# EAGLE design logicka sonda (EAGLE 7.7.0)
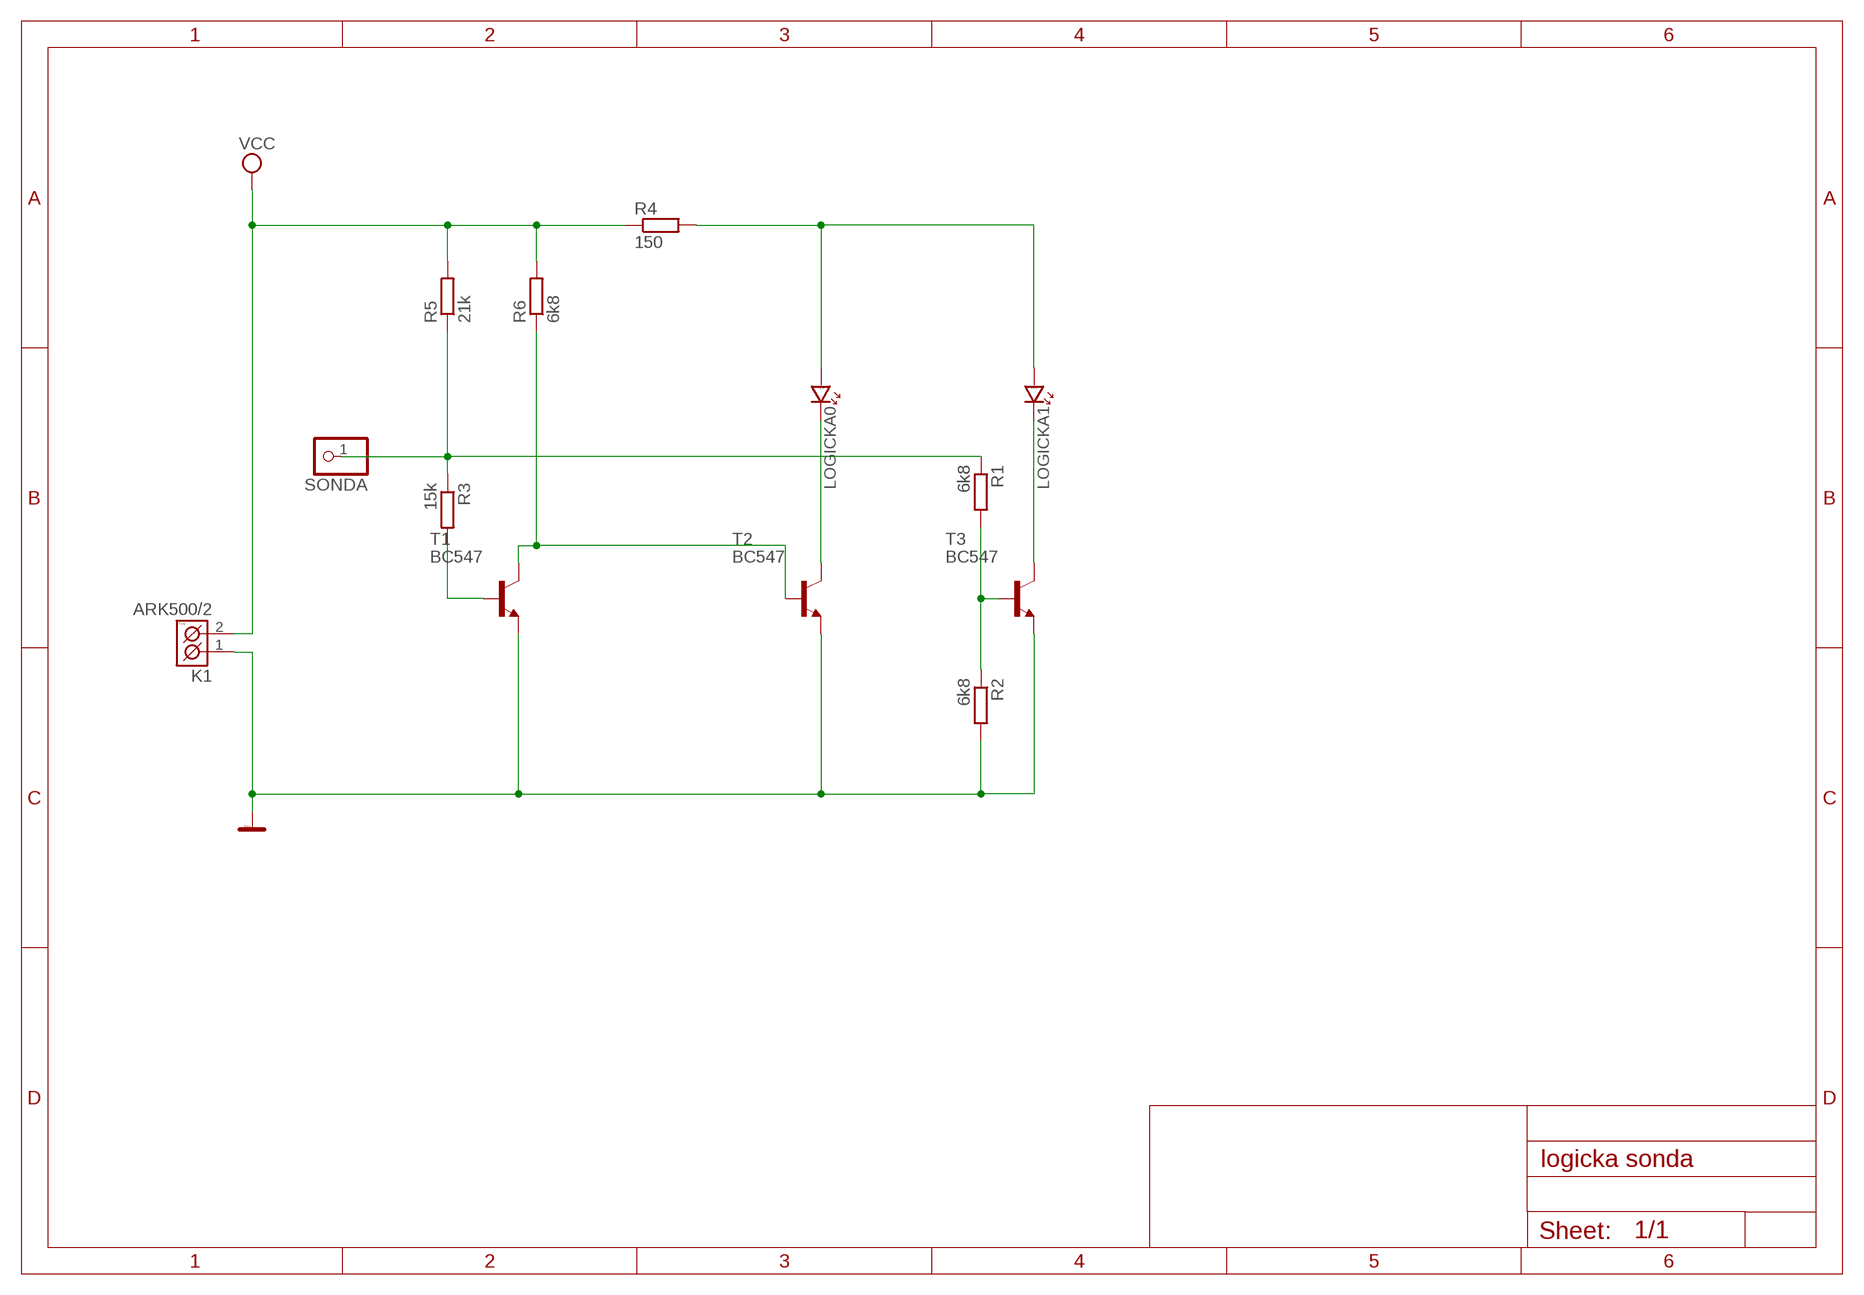
[diagram p0: schematic, sheet 1]

## Parts
K1  ARK500/2  [ARK500/2]
LOGICKA0  LED_5  [LED_5]
LOGICKA1  LED_5  [LED_5]
R1  6k8  R-EU_0207/10  [0207/10]
R2  6k8  R-EU_0207/10  [0207/10]
R3  15k  R-EU_0207/10  [0207/10]
R4  150  R-EU_0207/10  [0207/10]
R5  21k  R-EU_0207/10  [0207/10]
R6  6k8  R-EU_0207/10  [0207/10]
SONDA  PINHD-1X1  [1X01]
T1  BC547  [TO92]
T2  BC547  [TO92]
T3  BC547  [TO92]

## Nets
GND: K1.1(K1) R2.2 T1.1(E) T2.1(E) T3.1(E)
LOGICKA1: LOGICKA1.K T3.3(C)
N$1: R6.1 T1.3(C) T2.2(B)
N$2: R3.2 T1.2(B)
N$5: R1.2 R2.1 T3.2(B)
N$7: LOGICKA0.K T2.3(C)
N$8: LOGICKA0.A LOGICKA1.A R4.2
UF: R1.1 R3.1 R5.1 SONDA.1
VCC: K1.2(K2) R4.1 R5.2 R6.2

## Library data of the parts
K1 = #PaJa_konektory:ARK500/2: Svorkovnice - roztec 5mm - dvojita
LOGICKA0 LOGICKA1 = #PaJa_31:LED: LED - jednobarevna
R1-R6 = resistor:R-EU_: RESISTOR, European symbol
SONDA = pinhead:PINHD-1X1: PIN HEADER
T1-T3 = transistor:BC547: NPN TRANSISTOR

## Board
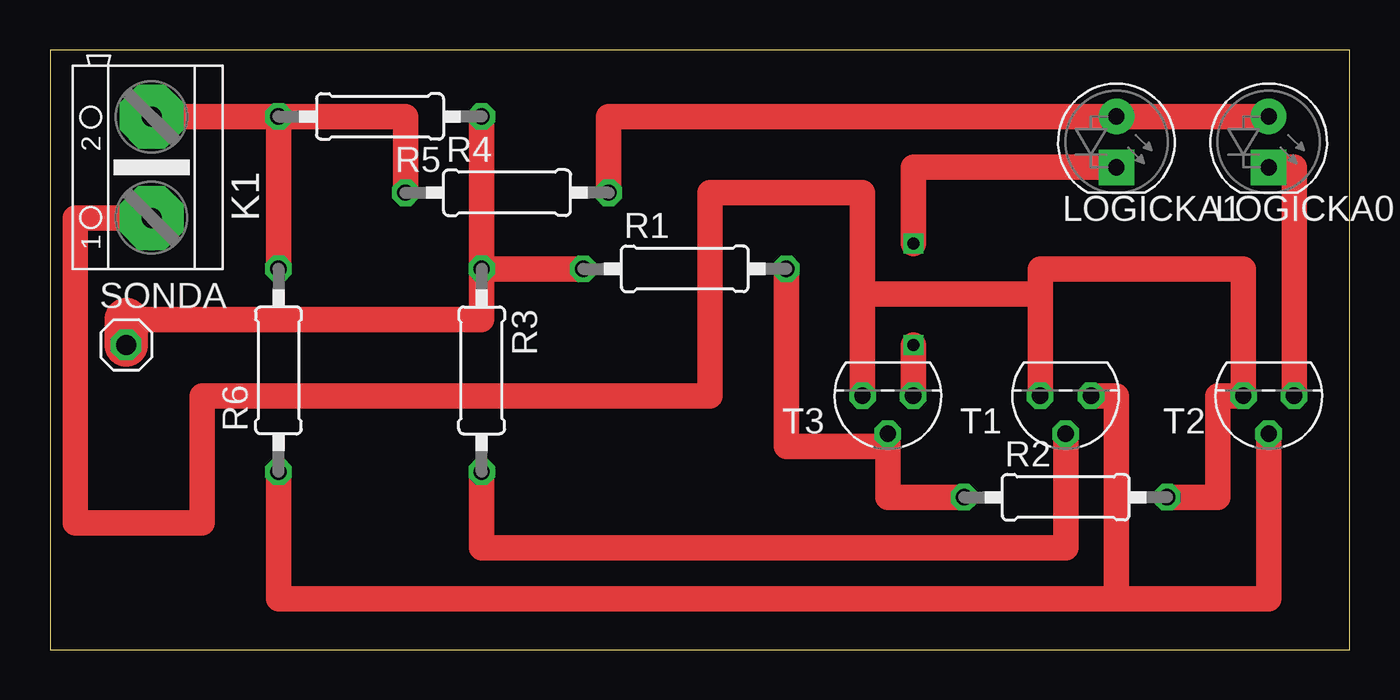
[diagram p1: board, top side]
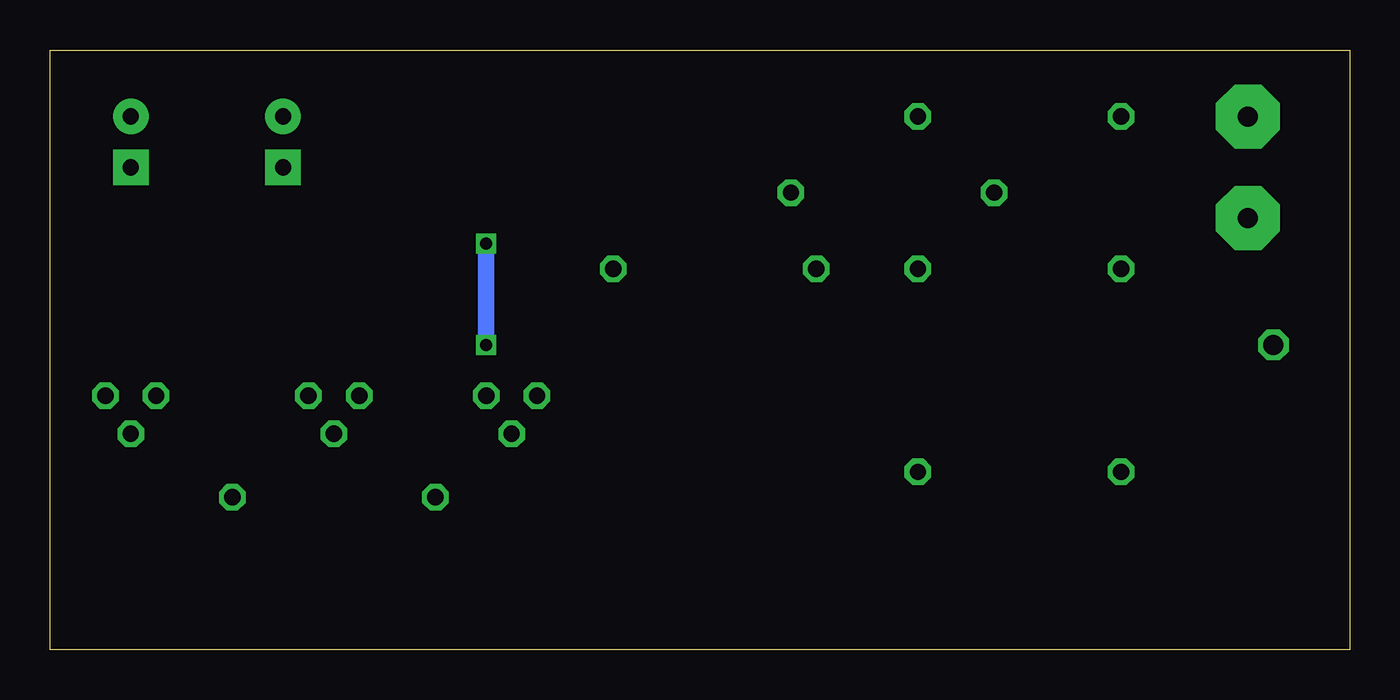
[diagram p2: board, bottom side, seen from below]

Size 65 x 30 mm. Coordinates in mm from the lower left corner, seen from the top.
Outline: 0,0 65,0 65,30 0,30 0,0
Copper layers (1*16): Top 0.035mm / dielectric 1.5mm / Bottom 0.035mm
Design rules "default": minimum track width 10mil, minimum drill 24mil, track to track 8mil, track to pad 8mil, pad to pad 8mil, via to via 8mil, smd to smd 8mil, copper to edge 40mil, drill to drill 8mil, minimum pad ring 10mil, minimum via ring 8mil, stop-mask expansion 4mil, vias tented up to drill 0mil, thermal gap 10mil

### Footprints (pad centres in the part's own frame; a part is rotated, then mirrored left to right if it is on the bottom)
ARK500/2 = drill 1 pad 3.2 octagon: 1 -2.54,0; 2 2.54,0
LED_5 = drill 0.813 pad 1.778: A -1.27,0 | drill 0.813 pad 1.778 square: K 1.27,0
0207/10 = drill 0.813 octagon: 1 -5.08,0; 2 5.08,0
1X01 = drill 1.016 octagon: 1 0,0
TO92 = drill 0.813 octagon: 1 1.27,0; 2 0,1.905; 3 -1.27,0

### Placement (x,y rotation side)
K1  5.08,24.13 90 top
LOGICKA0  60.96,25.4 270 top
LOGICKA1  53.34,25.4 270 top
R1  31.75,19.05 0 top
R2  50.8,7.62 0 top
R3  21.59,13.97 270 top
R4  22.86,22.86 0 top
R5  16.51,26.67 180 top
R6  11.43,13.97 90 top
SONDA  3.81,15.24 0 top
T1  50.8,12.7 180 top
T2  60.96,12.7 180 top
T3  41.91,12.7 180 top

### Tracks (layer width: path | path; a pad name or v marks a point on that pad's centre or on a via)
GND
  Top 1.27: R2.2 58.42,7.62 58.42,12.7 T2.1 59.69,19.05 49.53,19.05 49.53,17.78 | 40.64,17.78 40.64,22.86 33.02,22.86 33.02,12.7 7.62,12.7 7.62,6.35 1.27,6.35 1.27,21.59 K1.1 | T3.1 40.64,17.78 | 40.64,17.78 49.53,17.78 | 49.53,17.78 T1.1
LOGICKA1  (via drill 0.6)
  Top 1.27: LOGICKA1.K 43.18,24.13 v43.18,20.32 | v43.18,15.24 T3.3
  Bottom 0.813: v43.18,20.32 v43.18,15.24
N$1
  Top 1.27: T2.2 60.96,2.54 53.34,2.54 | 53.34,2.54 11.43,2.54 R6.1 | T1.3 53.34,12.7 53.34,2.54
N$2
  Top 1.27: R3.2 21.59,5.08 50.8,5.08 T1.2
N$3  (via drill 0.6)
  other vias: 43.18,15.24
N$5
  Top 1.27: R1.2 36.83,10.16 41.91,10.16 | 41.91,10.16 T3.2 | R2.1 41.91,7.62 41.91,10.16
N$7
  Top 1.27: T2.3 62.23,24.13 LOGICKA0.K
N$8
  Top 1.27: R4.2 27.94,26.67 LOGICKA1.A LOGICKA0.A
UF
  Top 1.27: R5.1 R3.1 | R3.1 R1.1 | 3.81,16.51 21.59,16.51 R3.1
  Top 2.184: SONDA.1 3.81,16.51
VCC
  Top 1.27: K1.2 R5.2 | R5.2 17.78,26.67 R4.1 | R6.2 R5.2